# Altium project Bernardo_01.PrjPcb
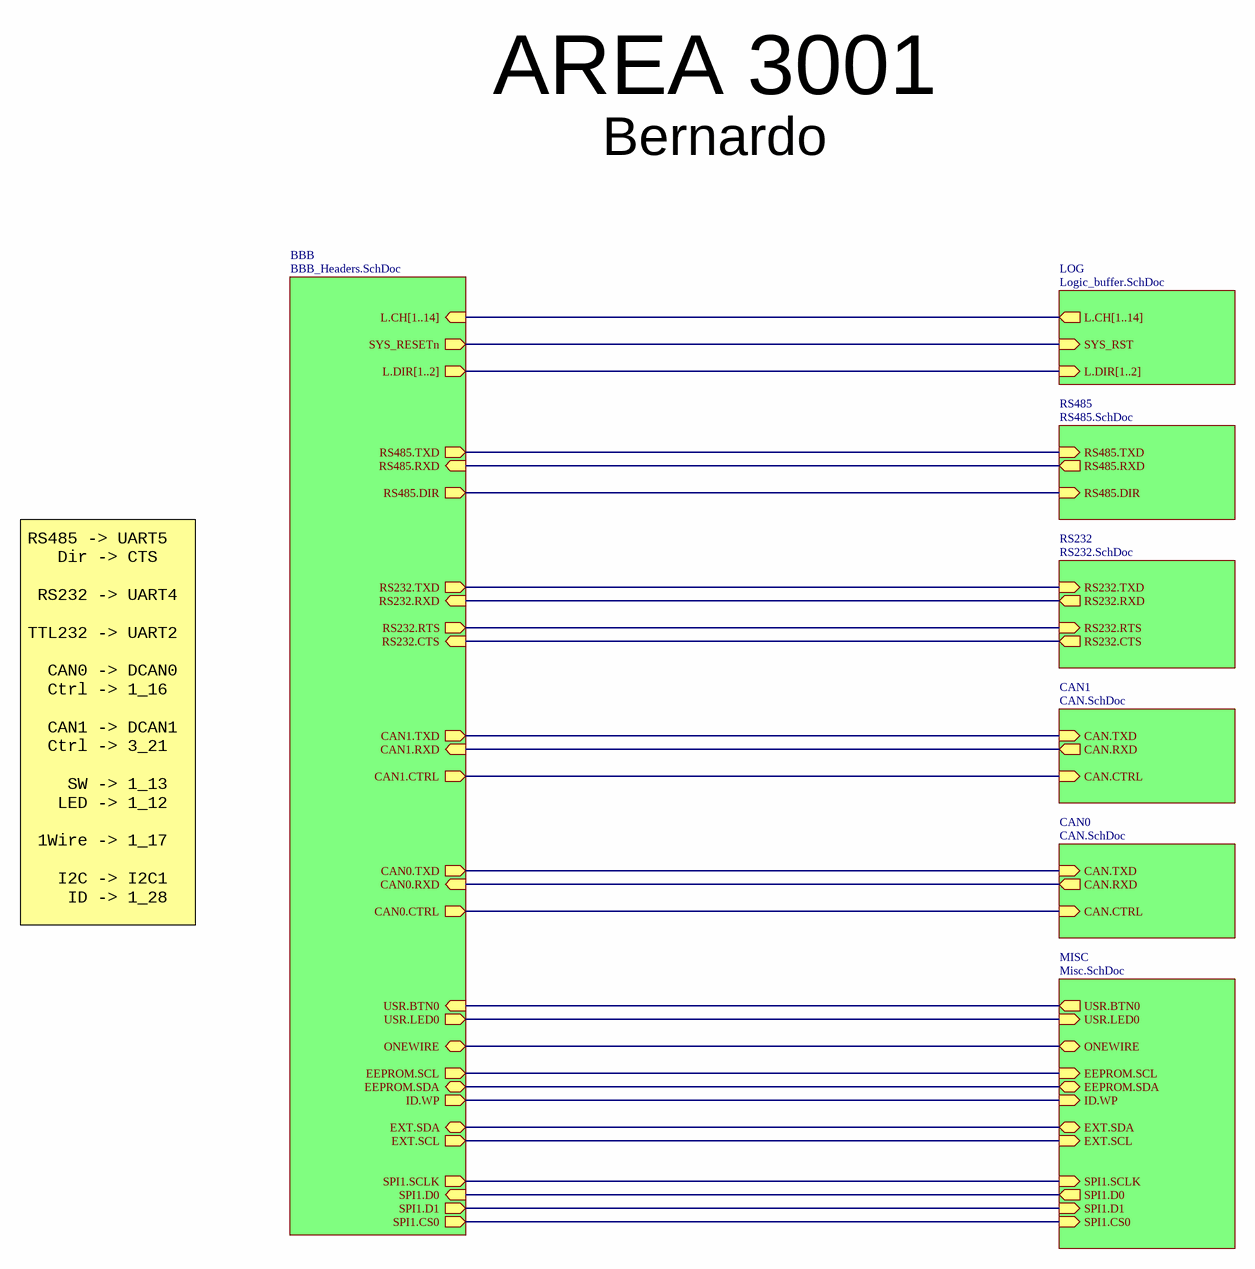
[diagram p0: Bernardo_01.SchDoc]
PCB_ENGINEER: WimVG; PCB_REV: 00; PCB_TITLE: Bernardo
7 sheets, 91 parts. Net scope: hierarchical (ports join the sheet entries above them; power ports are global).
Board file: Bernardo_01.PcbDoc
Sheets:
  Bernardo_01.SchDoc
    MISC = Misc.SchDoc
    RS485 = RS485.SchDoc
    BBB = BBB_Headers.SchDoc
    LOG = Logic_buffer.SchDoc
    RS232 = RS232.SchDoc
    CAN1 = CAN.SchDoc
    CAN0 = CAN.SchDoc

## Sheet Bernardo_01.SchDoc: Bernardo
size A3; Date: 14/11/2018; DrawnBy: Wim Van Gool; Revision: 01; SheetNumber: 1; SheetTotal: 7

### Sub-sheets
BBB = BBB_Headers.SchDoc: RS485.TXD (out), RS485.RXD (in), RS485.DIR (out), USR.BTN0 (in), USR.LED0 (out), EEPROM.SCL (out), EEPROM.SDA (bidir), ID.WP (out), EXT.SDA (bidir), EXT.SCL (out), L.CH[1..14] (in), SYS_RESETn (out), RS232.TXD (out), RS232.RXD (in), RS232.RTS (out), RS232.CTS (in), SPI1.CS0 (out), SPI1.D1 (out), SPI1.SCLK (out), SPI1.D0 (in), L.DIR[1..2] (out), CAN1.RXD (in), CAN1.TXD (out), CAN1.CTRL (out), ONEWIRE (bidir), CAN0.RXD (in), CAN0.TXD (out), CAN0.CTRL (out)
CAN0 = CAN.SchDoc: CAN.CTRL (in), CAN.RXD (out), CAN.TXD (in)
CAN1 = CAN.SchDoc: CAN.CTRL (in), CAN.RXD (out), CAN.TXD (in)
LOG = Logic_buffer.SchDoc: L.CH[1..14] (out), SYS_RST (in), L.DIR[1..2] (in)
MISC = Misc.SchDoc: USR.BTN0 (out), USR.LED0 (in), EEPROM.SDA (bidir), EEPROM.SCL (in), ID.WP (in), EXT.SDA (bidir), EXT.SCL (in), SPI1.SCLK (in), SPI1.D0 (out), SPI1.D1 (in), SPI1.CS0 (in), ONEWIRE (bidir)
RS232 = RS232.SchDoc: RS232.TXD (in), RS232.RXD (out), RS232.RTS (in), RS232.CTS (out)
RS485 = RS485.SchDoc: RS485.TXD (in), RS485.DIR (in), RS485.RXD (out)

### Nets
CAN.CTRL: sheet BBB/CAN0.CTRL, sheet CAN0/CAN.CTRL
CAN.CTRL: sheet BBB/CAN1.CTRL, sheet CAN1/CAN.CTRL  [a separate net that carries the same name]
CAN.RXD: sheet BBB/CAN0.RXD, sheet CAN0/CAN.RXD
CAN.RXD: sheet BBB/CAN1.RXD, sheet CAN1/CAN.RXD  [a separate net that carries the same name]
CAN.TXD: sheet BBB/CAN0.TXD, sheet CAN0/CAN.TXD
CAN.TXD: sheet BBB/CAN1.TXD, sheet CAN1/CAN.TXD  [a separate net that carries the same name]
EEPROM.SCL: sheet MISC/EEPROM.SCL, sheet MISC/EXT.SCL, sheet BBB/EEPROM.SCL, sheet BBB/EXT.SCL
EEPROM.SDA: sheet MISC/EEPROM.SDA, sheet MISC/EXT.SDA, sheet BBB/EEPROM.SDA, sheet BBB/EXT.SDA
GPIO1_12: sheet MISC/USR.LED0, sheet BBB/USR.LED0
GPIO1_13: sheet MISC/USR.BTN0, sheet BBB/USR.BTN0
GPIO1_17: sheet MISC/ONEWIRE, sheet BBB/ONEWIRE
GPIO1_28: sheet MISC/ID.WP, sheet BBB/ID.WP
RS232.CTS: sheet BBB/RS232.CTS, sheet RS232/RS232.CTS
RS232.RTS: sheet BBB/RS232.RTS, sheet RS232/RS232.RTS
RS232.RXD: sheet BBB/RS232.RXD, sheet RS232/RS232.RXD
RS232.TXD: sheet BBB/RS232.TXD, sheet RS232/RS232.TXD
RS485.DIR: sheet RS485/RS485.DIR, sheet BBB/RS485.DIR
RS485.RXD: sheet RS485/RS485.RXD, sheet BBB/RS485.RXD
RS485.TXD: sheet RS485/RS485.TXD, sheet BBB/RS485.TXD
SPI1.CS0: sheet MISC/SPI1.CS0, sheet BBB/SPI1.CS0
SPI1.D0: sheet MISC/SPI1.D0, sheet BBB/SPI1.D0
SPI1.D1: sheet MISC/SPI1.D1, sheet BBB/SPI1.D1
SPI1.SCLK: sheet MISC/SPI1.SCLK, sheet BBB/SPI1.SCLK
SYS_RESETn: sheet BBB/SYS_RESETn, sheet LOG/SYS_RST

### Buses and harness runs
bus sheet BBB/L.CH[1..14] = sheet LOG/L.CH[1..14]
bus sheet BBB/L.DIR[1..2] = sheet LOG/L.DIR[1..2]

### Notes on the sheet
- AREA 3001
- Bernardo
- RS485 -> UART5
  Dir -> CTS
  RS232 -> UART4
  TTL232 -> UART2
  CAN0 -> DCAN0
  Ctrl -> 1_16
  CAN1 -> DCAN1
  Ctrl -> 3_21
  SW -> 1_13
  LED -> 1_12
  1Wire -> 1_17
  I2C -> I2C1
  ID -> 1_28
- Title
- Revision
- Date
- Dranw By
- Size
- A3
- Sheet
- of

## Sheet Misc.SchDoc: Bernardo
size A3; Date: 14/11/2018; DrawnBy: Wim Van Gool; Revision: 01; SheetNumber: 4; SheetTotal: 7
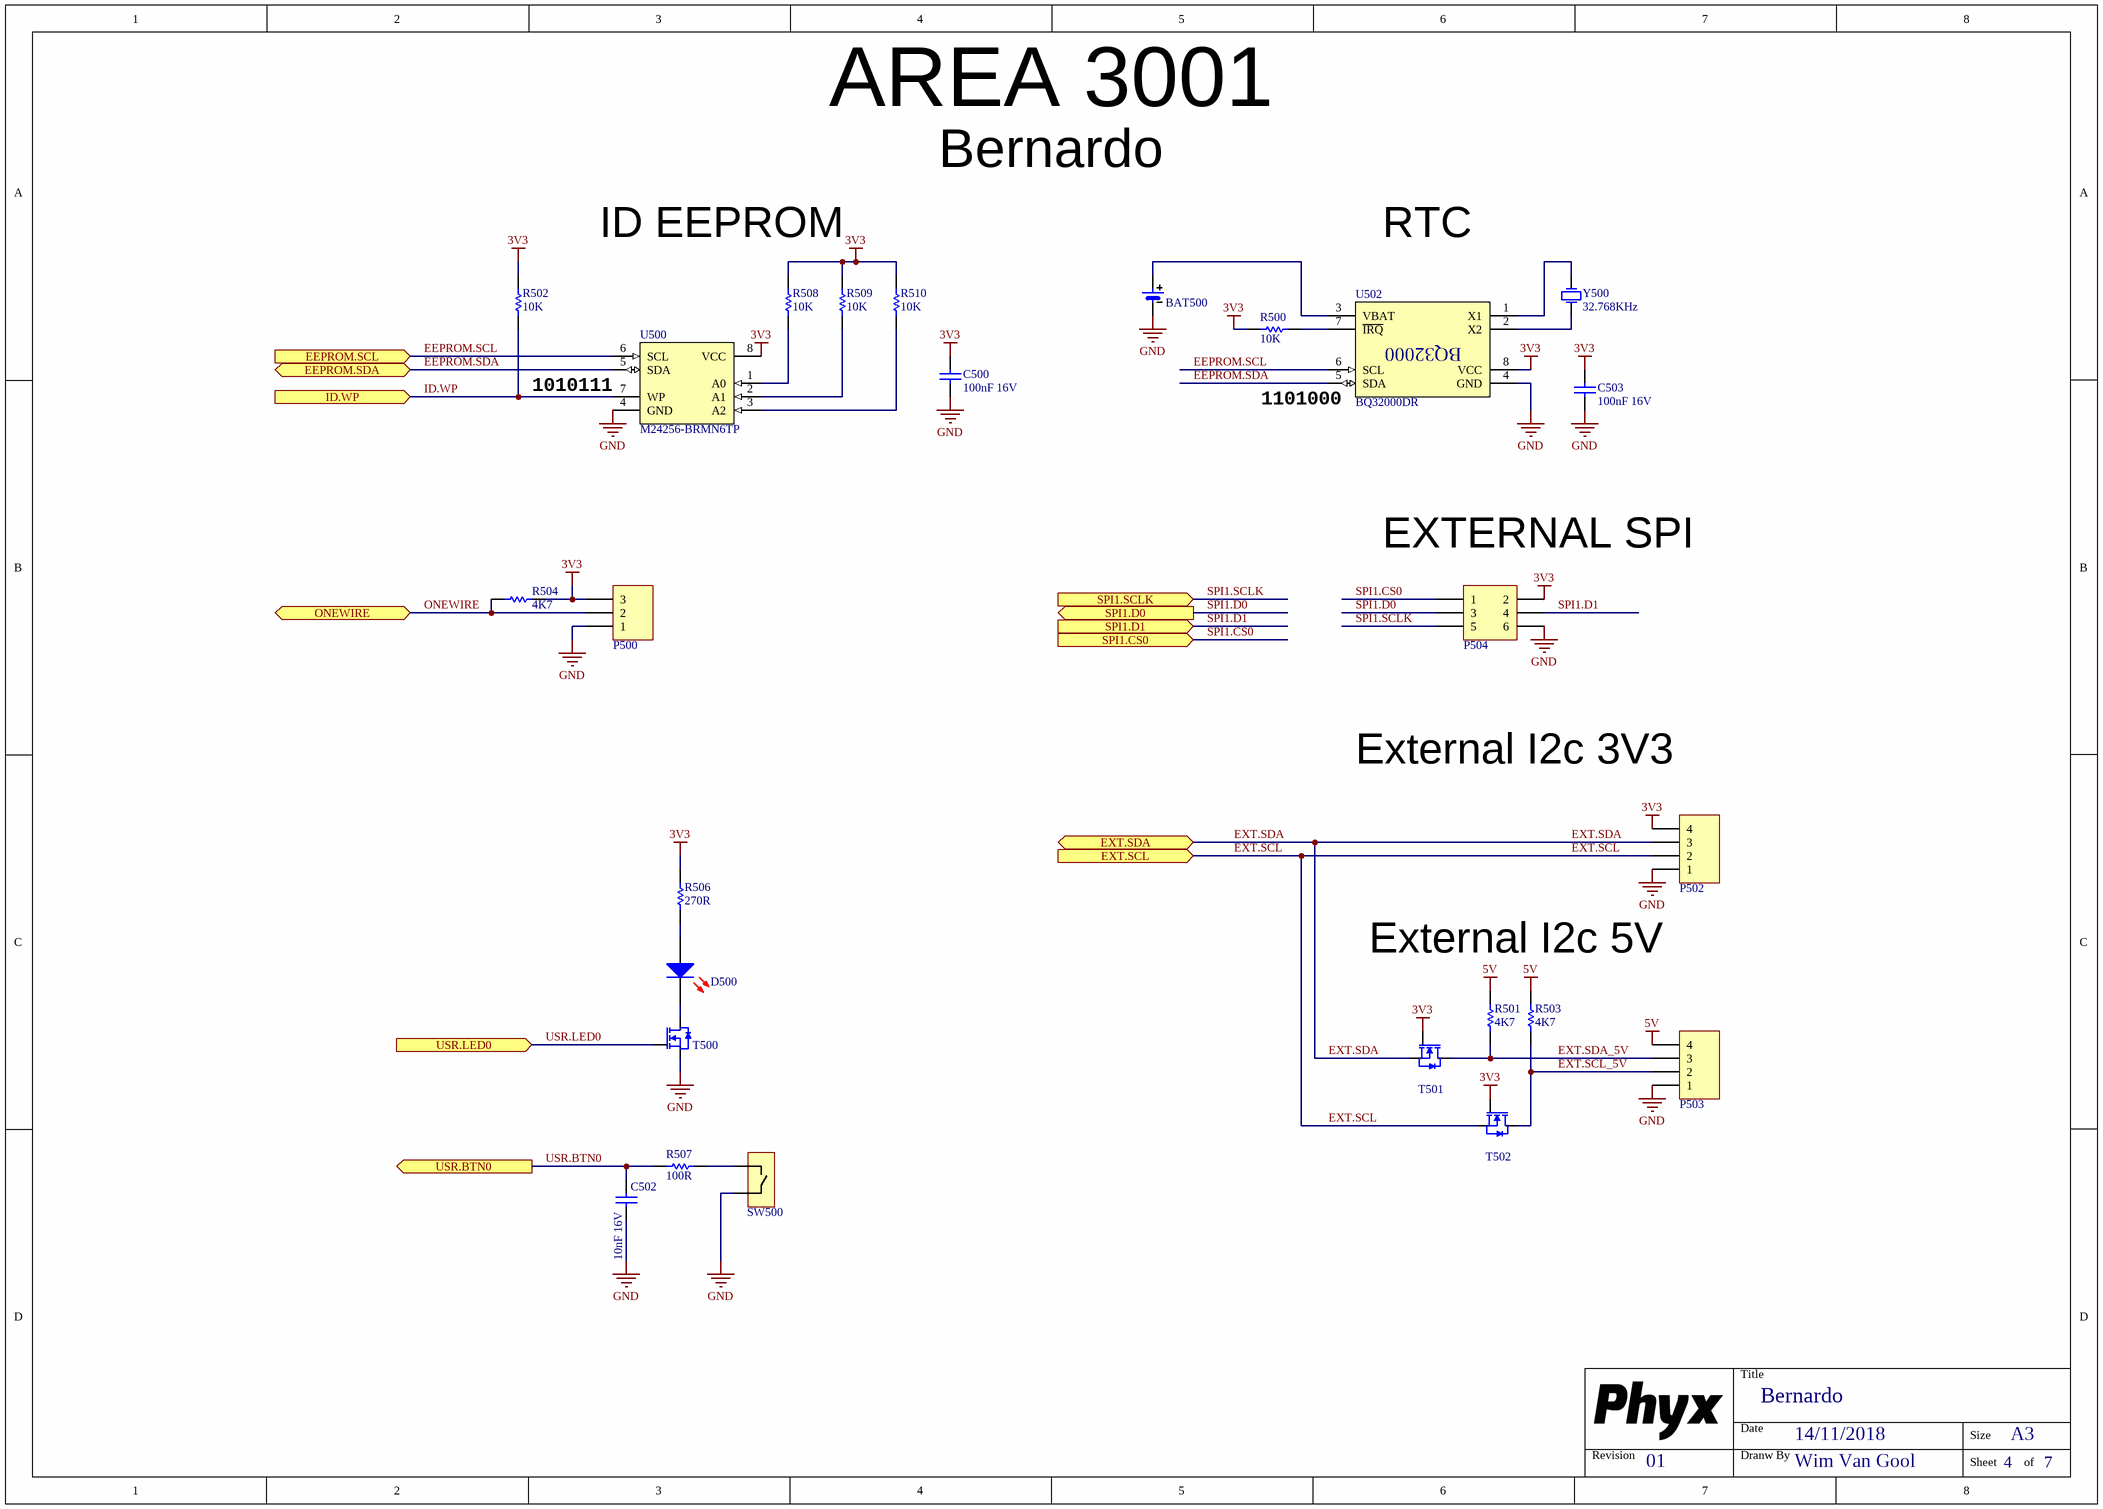
[diagram p1: Misc.SchDoc]

### Parts
BAT500  BR-1220/HFN 35mAh  [BR-1220_HFN]  (value not drawn)
C500  value 100nF 16V  [C0603_N]  (hidden comment: CAP_CERAMIC)
C502  value 10nF 16V  [C0603_N]  (hidden comment: CAP_CERAMIC)
C503  value 100nF 16V  [C0603_N]  (hidden comment: CAP_CERAMIC)
D500  Default 0805 Red LED  [LED_0805_RD]  (value not drawn)
P500  Header 3  [HDR1X3]  (value not drawn)
P502  Header 4  [HDR1X4]  (value not drawn)
P503  Header 4  [HDR1X4]  (value not drawn)
P504  Header 3X2  [HDR2X3]  (value not drawn)
R500  value 10K  [R0603_N]  (hidden comment: RESISTOR)
R501  value 4K7  [R0603_N]  (hidden comment: RESISTOR)
R502  value 10K  [R0603_N]  (hidden comment: RESISTOR)
R503  value 4K7  [R0603_N]  (hidden comment: RESISTOR)
R504  value 4K7  [R0603_N]  (hidden comment: RESISTOR)
R506  value 270R  [R0603_N]  (hidden comment: RESISTOR)
R507  value 100R  [R0603_N]  (hidden comment: RESISTOR)
R508  value 10K  [R0603_N]  (hidden comment: RESISTOR)
R509  value 10K  [R0603_N]  (hidden comment: RESISTOR)
R510  value 10K  [R0603_N]  (hidden comment: RESISTOR)
SW500  Default TH TACT  [TACTSW]  (value not drawn)
T500  0.2A N-Ch MOSFET Vgs 3.2  [SOT23-3]  (value not drawn)
T501  0.2A N-Ch MOSFET Vgs 3.2  [SOT23-3]  (value not drawn)
T502  0.2A N-Ch MOSFET Vgs 3.2  [SOT23-3]  (value not drawn)
U500  value M24256-BRMN6TP  [SOIC_N_8]  (hidden comment: Serial EEPROM 256Kb (8b) I2C)
U502  value BQ32000DR  [SOIC_N_8]  (hidden comment: I2C RTC Ti BQ32000)
Y500  value 32.768KHz  [CMR200T]  (hidden comment: 32.768Khz CMR200 12.5pF)

### Ports
EEPROM.SCL (in), EEPROM.SDA (bidir), EXT.SCL (in), EXT.SDA (bidir), ID.WP (in), ONEWIRE (bidir), SPI1.CS0 (in), SPI1.D0 (out), SPI1.D1 (in), SPI1.SCLK (in), USR.BTN0 (out), USR.LED0 (in)

### Nets
3V3: C500.1 C503.1 P500.3 P502.4 P504.2 R500.1 R502.1 R504.2 R506.1 R508.1 R509.1 R510.1 T501.1(G) T502.1(G) U500.8(VCC) U502.8(VCC)
5V: P503.4 R501.1 R503.1
GND: BAT500.2 C500.2 C502.2 C503.2 P500.1 P502.1 P503.1 P504.6 SW500.2 T500.2(S) U500.4(GND) U502.4(GND)
EEPROM.SCL: P502.2 T502.2(S) U500.6(SCL) U502.6(SCL) ; port EEPROM.SCL, port EXT.SCL  [also labelled EXT.SCL]
EEPROM.SDA: P502.3 T501.2(S) U500.5(SDA) U502.5(SDA) ; port EEPROM.SDA, port EXT.SDA  [also labelled EXT.SDA]
EXT.SCL_5V: P503.2 R503.2 T502.3(D)
EXT.SDA_5V: P503.3 R501.2 T501.3(D)
ID.WP: R502.2 U500.7(WP) ; port ID.WP  [project net GPIO1_28]
ONEWIRE: P500.2 R504.1 ; port ONEWIRE  [project net GPIO1_17]
SPI1.CS0: P504.1 ; port SPI1.CS0
SPI1.D0: P504.3 ; port SPI1.D0
SPI1.D1: P504.4 ; port SPI1.D1
SPI1.SCLK: P504.5 ; port SPI1.SCLK
USR.BTN0: C502.1 R507.2 ; port USR.BTN0  [project net GPIO1_13]
USR.LED0: T500.1(G) ; port USR.LED0  [project net GPIO1_12]
NetBAT500_1: BAT500.1 U502.3(VBAT)
NetD500_1: D500.1(A) R506.2
NetD500_2: D500.2(K) T500.3(D)
NetR500_2: R500.2 U502.7(~{IRQ})
NetR507_1: R507.1 SW500.1
NetR508_2: R508.2 U500.1(A0)
NetR509_2: R509.2 U500.2(A1)
NetR510_2: R510.2 U500.3(A2)
NetU502_1: U502.1(X1) Y500.2(OSC2)
NetU502_2: U502.2(X2) Y500.1(OSC1)

### Notes on the sheet
- AREA 3001
- Bernardo
- ID EEPROM
- RTC
- 1010111
- (near U502) 1101000
- (near P504) EXTERNAL SPI
- External I2c 3V3
- External I2c 5V
- Title
- Revision
- Date
- Dranw By
- Size
- A3
- Sheet
- of

### Library data of the parts
BAT500 = BAT BR-1220/HFN: =Description; Value: 1220; Supplier 1: Farnell; Supplier Part Number 1: 1892653
C500 C503 = CAP # 100nF 16V 0603: Capacitor Ceramic
C502 = CAP # 10nF 16V 0603: Capacitor Ceramic
D500 = LED # Red 0805: =Description; Supplier 1: Farnell; Supplier Part Number 1: 2099236
P500 = Pin Header 2.54mm 3way
P502 P503 = Pin Header 2.54mm 4way
P504 = Pin Header 2.54mm dual row 6way
R500 R502 R508-R510 = RES # 10K 0603: Supplier 1: Farnell; Supplier Part Number 1: 2502397
R501 R503 R504 = RES # 4K7 0603
R506 = RES # 270R 0603: Supplier 1: Farnell; Supplier Part Number 1: 2497841
R507 = RES # 100R 0603
SW500 = SW TACT
T500-T502 = BSS138 N-Ch MOSFET 0.2A 3.2Vgs 60Vds: Value: BSS138; Supplier 1: Farnell; Supplier Part Number 1: 2432717
U500 = EEPROM # I2C 32KKx8b M24256-BRMN6TP: =Description; Supplier 1: Digikey; Supplier Part Number 1: 497-6348-1-ND
U502 = RTC # BQ32000: =Description; Supplier 1: Farnell; Supplier Part Number 1: 1754773
Y500 = XTAL # 32.768Khz 12.5pF CMR200: Crystal Oscillator; Supplier 1: Farnell; Supplier Part Number 1: 2101359

## Sheet RS485.SchDoc: Bernardo
size A3; Date: 14/11/2018; DrawnBy: Wim Van Gool; Revision: 01; SheetNumber: 5; SheetTotal: 7
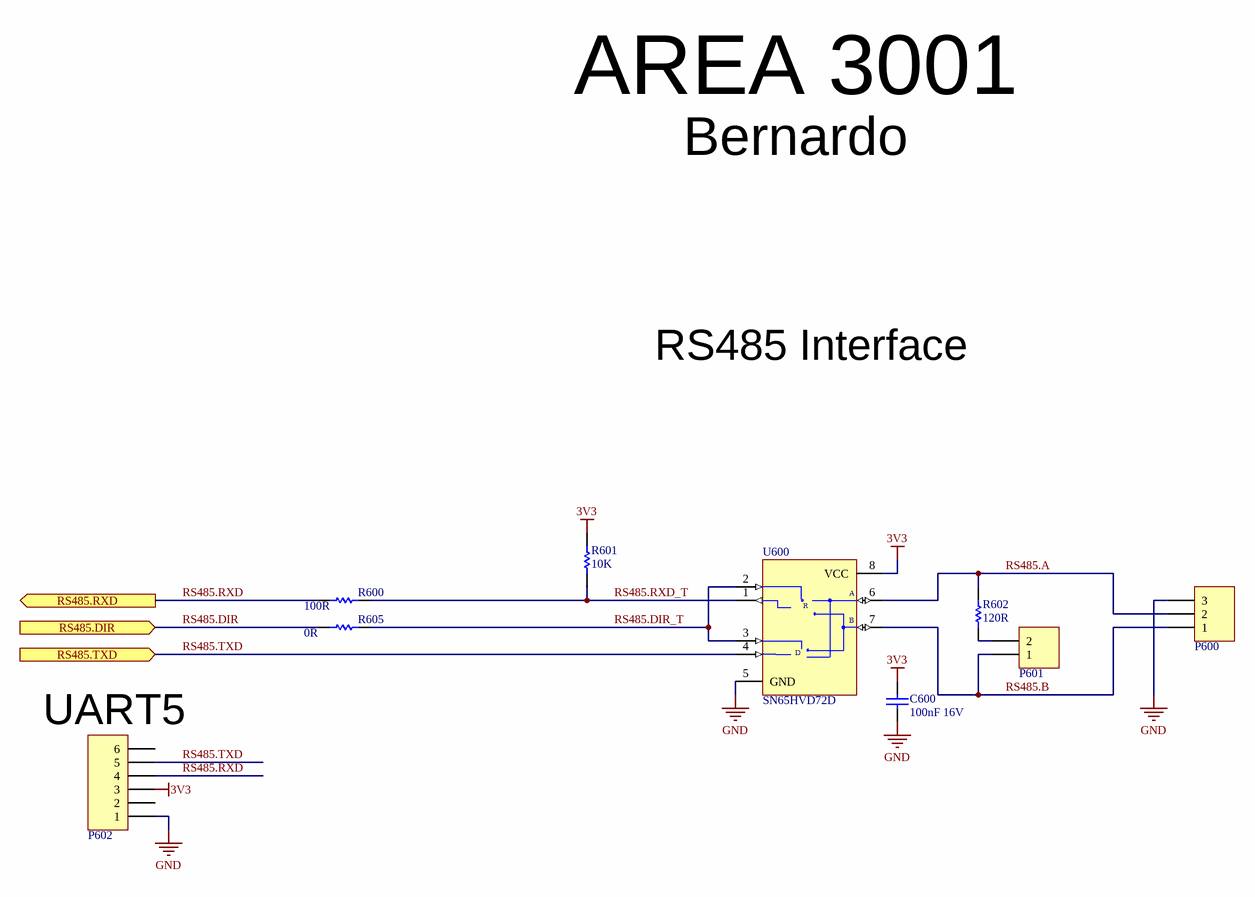
[diagram p2: RS485.SchDoc]

### Parts
C600  value 100nF 16V  [C0603_N]  (hidden comment: CAP_CERAMIC)
P600  3 Terminal Socket 2,5mm  [WE_691382000003]  (value not drawn)
P601  Header 2  [HDR1X2]  (value not drawn)
P602  Header 6  [HDR1X6]  (value not drawn)
R600  value 100R  [R0603_N]  (hidden comment: RESISTOR)
R601  value 10K  [R0603_N]  (hidden comment: RESISTOR)
R602  value 120R  [R1206]  (hidden comment: RESISTOR)
R605  value 0R  [R0603_N]  (hidden comment: RESISTOR)
U600  value SN65HVD72D  [SOIC_N_8]  (hidden comment: RS-485 3V3 Transceiver 250kbps)

### Ports
RS485.DIR (in), RS485.RXD (out), RS485.TXD (in)

### Nets
3V3: C600.1 P602.3 R601.1 U600.8(VCC)
GND: C600.2 P600.3 P602.1 U600.5(GND)
RS485.A: P600.2 R602.1 U600.6(A)
RS485.B: P600.1 P601.1 U600.7(B)
RS485.DIR: R605.2 ; port RS485.DIR
RS485.DIR_T: R605.1 U600.2(~{RE}) U600.3(DE)
RS485.RXD: P602.4 R600.2 ; port RS485.RXD
RS485.RXD_T: R600.1 R601.2 U600.1(RO)
RS485.TXD: P602.5 U600.4(DI) ; port RS485.TXD
NetP601_2: P601.2 R602.2

Not connected (* = marked no-connect by the designer): P602 2 6

### Notes on the sheet
- AREA 3001
- Bernardo
- RS485 Interface
- (near P602) UART5
- Title
- Revision
- Date
- Dranw By
- Size
- A3
- Sheet
- of
- (in symbol SN65HVD72D # RS-485 transceiver) R; D

### Library data of the parts
C600 = CAP # 100nF 16V 0603: Capacitor Ceramic
P600 = Terminal Block Socket 2,5mm 3way - 691382000003: Value: 691382000003; Supplier 1: Wurth; Supplier Part Number 1: 691382000003
P601 = Pin Header 2.54mm 2way
P602 = Pin Header 2.54mm 6way
R600 = RES # 100R 0603
R601 = RES # 10K 0603: Supplier 1: Farnell; Supplier Part Number 1: 2502397
R602 = RES # 120R 1206
R605 = RES # 0R 0603: Supplier 1: Farnell; Supplier Part Number 1: 2447743
U600 = SN65HVD72D # RS-485 transceiver: Supplier 1: Farnell; Supplier Part Number 1: 2335547

## Sheet BBB_Headers.SchDoc: Bernardo
size A3; Date: 14/11/2018; DrawnBy: Wim Van Gool; Revision: 01; SheetNumber: 2; SheetTotal: 7
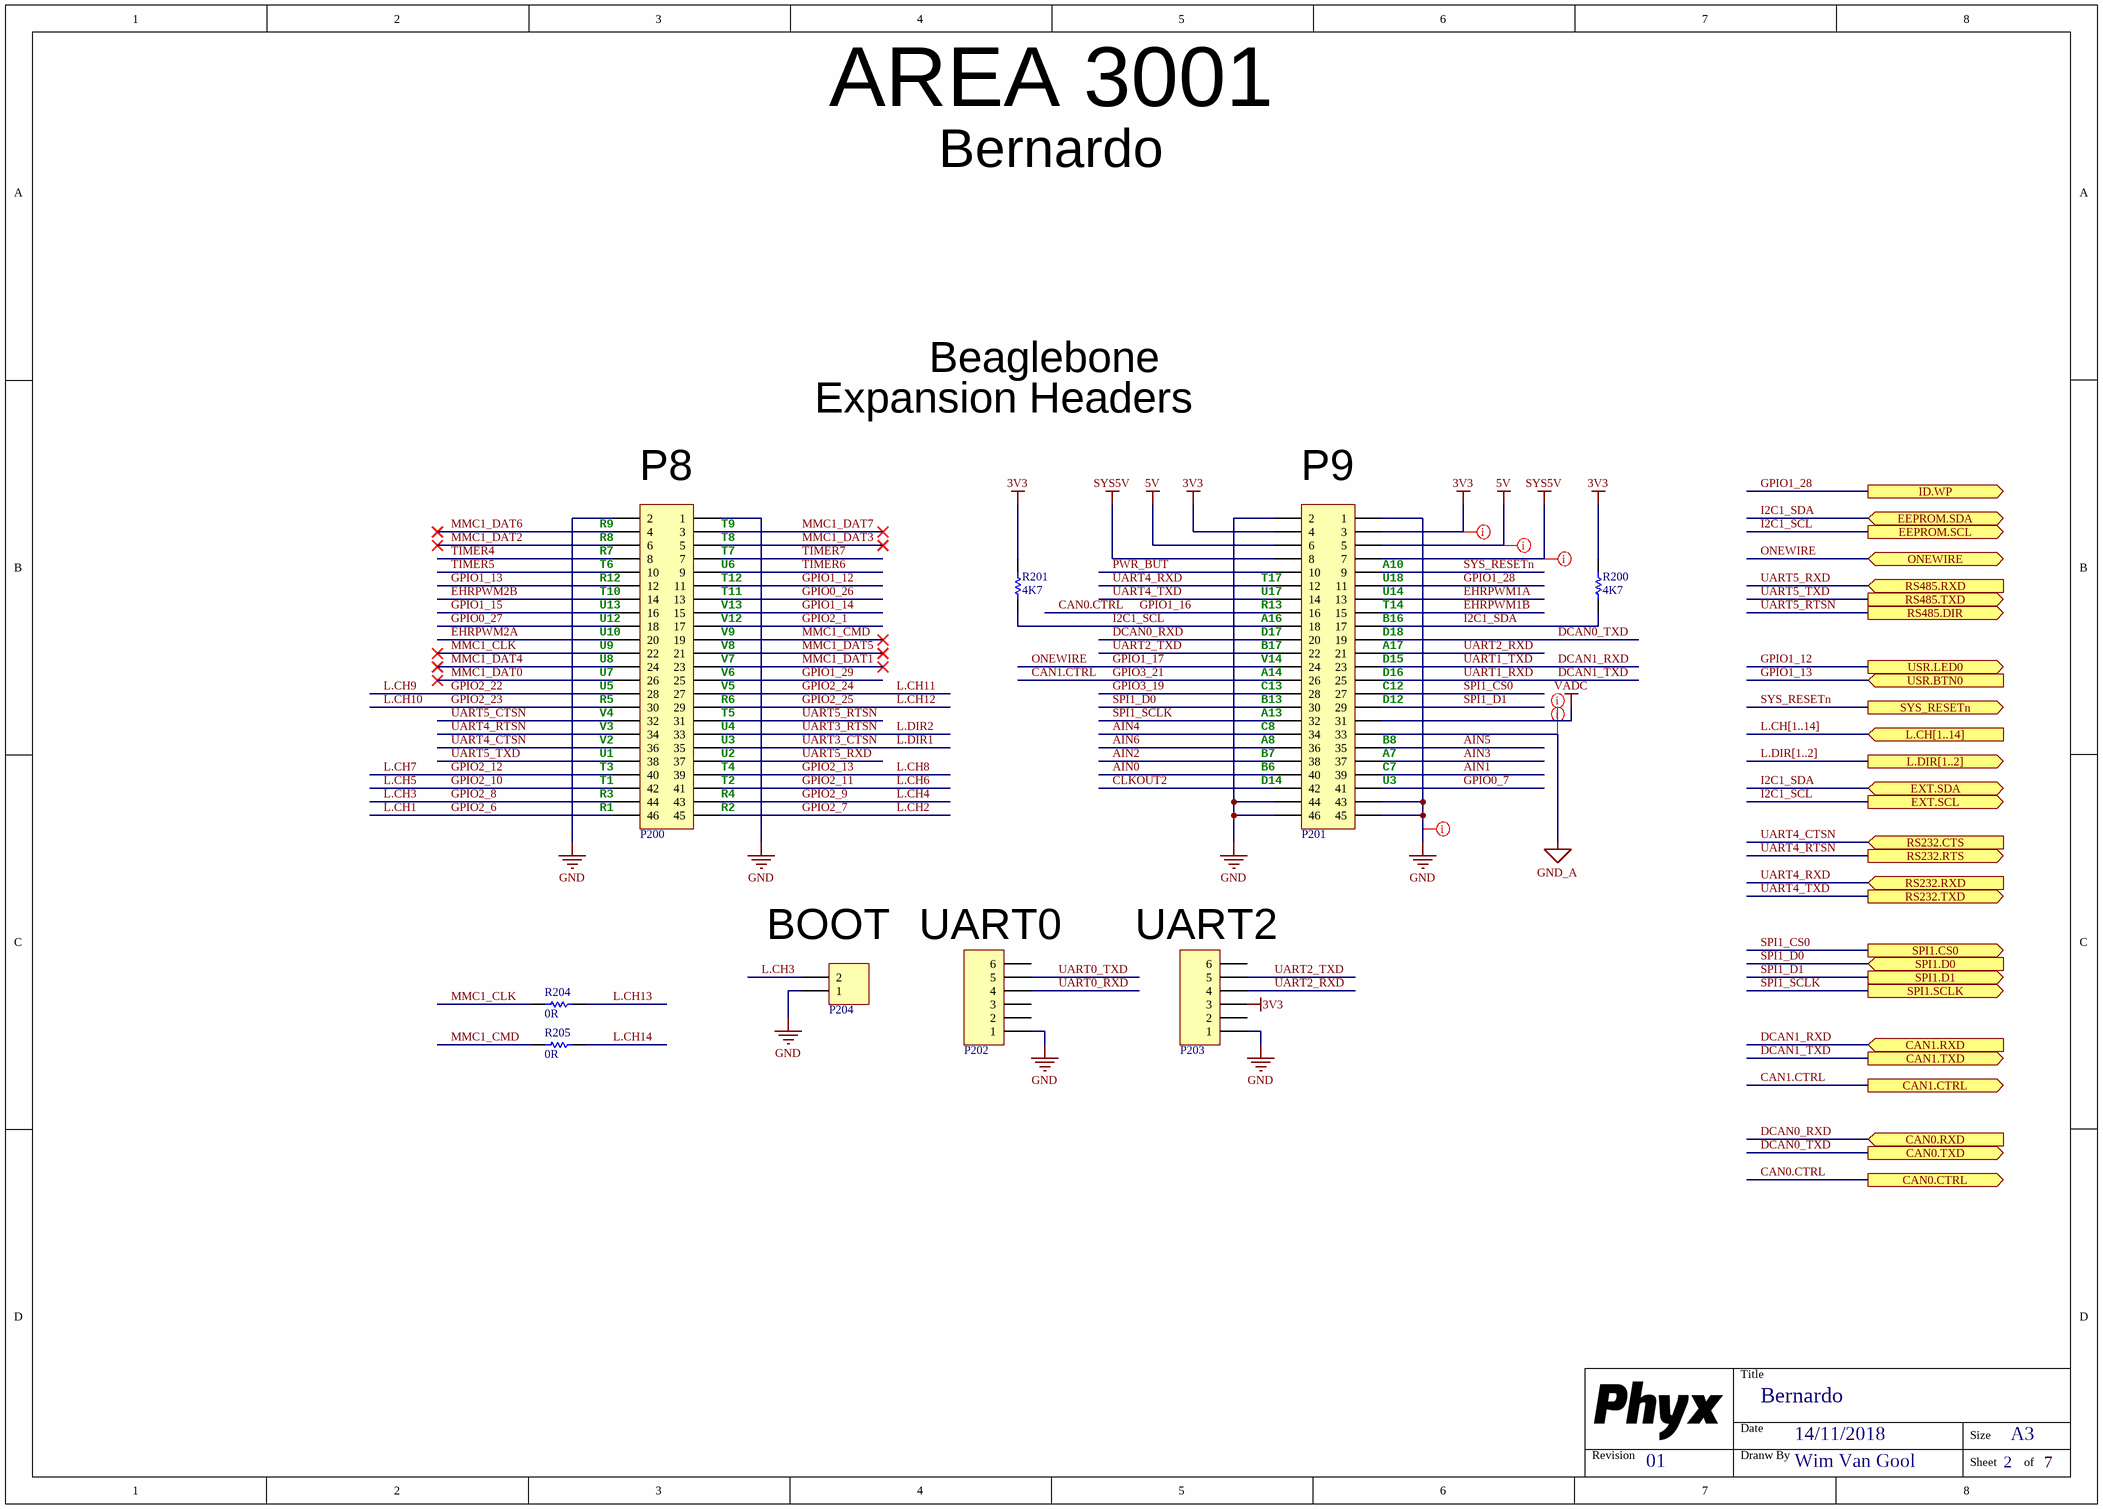
[diagram p3: BBB_Headers.SchDoc]

### Parts
P200  Receptacle 23X2  [HDR2X23]  (value not drawn)
P201  Receptacle 23X2  [HDR2X23]  (value not drawn)
P202  Receptacle 6  [RCPT1X6]  (value not drawn)
P203  Header 6  [HDR1X6]  (value not drawn)
P204  Header 2  [HDR1X2]  (value not drawn)
R200  value 4K7  [R0603_N]  (hidden comment: RESISTOR)
R201  value 4K7  [R0603_N]  (hidden comment: RESISTOR)
R204  value 0R  [R0603_N]  (hidden comment: RESISTOR)
R205  value 0R  [R0603_N]  (hidden comment: RESISTOR)

### Ports
CAN0.CTRL (out), CAN0.RXD (in), CAN0.TXD (out), CAN1.CTRL (out), CAN1.RXD (in), CAN1.TXD (out), EEPROM.SCL (out), EEPROM.SDA (bidir), EXT.SCL (out), EXT.SDA (bidir), ID.WP (out), L.CH[1..14] (in), L.DIR[1..2] (out), ONEWIRE (bidir), RS232.CTS (in), RS232.RTS (out), RS232.RXD (in), RS232.TXD (out), RS485.DIR (out), RS485.RXD (in), RS485.TXD (out), SPI1.CS0 (out), SPI1.D0 (in), SPI1.D1 (out), SPI1.SCLK (out), SYS_RESETn (out), USR.BTN0 (in), USR.LED0 (out)

### Nets
3V3: P201.3 P201.4 P203.3 R200.1 R201.2
5V: P201.5 P201.6
GND: P200.1 P200.2 P201.1 P201.2 P201.43 P201.44 P201.45 P201.46 P202.1 P203.1 P204.1
GND_A: P201.33
SYS5V: P201.7 P201.8
VADC: P201.31
AIN0: P201.40
AIN1: P201.39
AIN2: P201.38
AIN3: P201.37
AIN4: P201.34
AIN5: P201.35
AIN6: P201.36
CAN0.CTRL: P201.16 ; port CAN0.CTRL  [also labelled GPIO1_16]  [project net CAN.CTRL]
CAN1.CTRL: P201.26 ; port CAN1.CTRL  [also labelled GPIO3_21]  [project net CAN.CTRL]
CLKOUT2: P201.42
DCAN0_RXD: P201.20 ; port CAN0.RXD  [project net CAN.RXD]
DCAN0_TXD: P201.19 ; port CAN0.TXD  [project net CAN.TXD]
DCAN1_RXD: P201.23 ; port CAN1.RXD  [also labelled UART1_TXD]  [project net CAN.RXD]
DCAN1_TXD: P201.25 ; port CAN1.TXD  [also labelled UART1_RXD]  [project net CAN.TXD]
EHRPWM1A: P201.13
EHRPWM1B: P201.15
EHRPWM2A: P200.20
EHRPWM2B: P200.14
GPIO0_7: P201.41
GPIO0_26: P200.13
GPIO0_27: P200.18
GPIO1_12: P200.11 ; port USR.LED0
GPIO1_13: P200.12 ; port USR.BTN0
GPIO1_14: P200.15
GPIO1_15: P200.16
GPIO1_17: P201.24 ; port ONEWIRE  [also labelled ONEWIRE]
GPIO1_28: P201.11 ; port ID.WP
GPIO1_29: P200.25
GPIO2_1: P200.17
GPIO2_6: P200.46  [also labelled L.CH1]
GPIO2_7: P200.45  [also labelled L.CH2]
GPIO2_8: P200.44 P204.2  [also labelled L.CH3]
GPIO2_9: P200.43  [also labelled L.CH4]
GPIO2_10: P200.42  [also labelled L.CH5]
GPIO2_11: P200.41  [also labelled L.CH6]
GPIO2_12: P200.40  [also labelled L.CH7]
GPIO2_13: P200.39  [also labelled L.CH8]
GPIO2_22: P200.28  [also labelled L.CH9]
GPIO2_23: P200.30  [also labelled L.CH10]
GPIO2_24: P200.27  [also labelled L.CH11]
GPIO2_25: P200.29  [also labelled L.CH12]
GPIO3_19: P201.28
I2C1_SCL: P201.18 R201.1 ; port EEPROM.SCL, port EXT.SCL  [project net EEPROM.SCL]
I2C1_SDA: P201.17 R200.2 ; port EEPROM.SDA, port EXT.SDA  [project net EEPROM.SDA]
L.CH13: R204.1
L.CH14: R205.1
L.DIR1: P200.35  [also labelled UART3_CTSN]
L.DIR2: P200.33  [also labelled UART3_RTSN]
MMC1_CLK: P200.22 R204.2
MMC1_CMD: P200.19 R205.2
MMC1_DAT0: P200.26
MMC1_DAT1: P200.23
MMC1_DAT2: P200.6
MMC1_DAT3: P200.5
MMC1_DAT4: P200.24
MMC1_DAT5: P200.21
MMC1_DAT6: P200.4
MMC1_DAT7: P200.3
PWR_BUT: P201.10
SPI1_CS0: P201.27 ; port SPI1.CS0  [project net SPI1.CS0]
SPI1_D0: P201.30 ; port SPI1.D0  [project net SPI1.D0]
SPI1_D1: P201.29 ; port SPI1.D1  [project net SPI1.D1]
SPI1_SCLK: P201.32 ; port SPI1.SCLK  [project net SPI1.SCLK]
SYS_RESETn: P201.9 ; port SYS_RESETn
TIMER4: P200.8
TIMER5: P200.10
TIMER6: P200.9
TIMER7: P200.7
UART0_RXD: P202.4
UART0_TXD: P202.5
UART2_RXD: P201.21 P203.4
UART2_TXD: P201.22 P203.5
UART4_CTSN: P200.36 ; port RS232.CTS  [project net RS232.CTS]
UART4_RTSN: P200.34 ; port RS232.RTS  [project net RS232.RTS]
UART4_RXD: P201.12 ; port RS232.RXD  [project net RS232.RXD]
UART4_TXD: P201.14 ; port RS232.TXD  [project net RS232.TXD]
UART5_CTSN: P200.32
UART5_RTSN: P200.31 ; port RS485.DIR  [project net RS485.DIR]
UART5_RXD: P200.37 ; port RS485.RXD  [project net RS485.RXD]
UART5_TXD: P200.38 ; port RS485.TXD  [project net RS485.TXD]

Not connected (* = marked no-connect by the designer): P202 2 3 6; P203 2 6

### Buses and harness runs
bus L.CH[1..14] = port L.CH[1..14]
bus L.DIR[1..2] = port L.DIR[1..2]

### Layout directives
net class POWER: 3V3, 5V, GND, GND_A, SYS5V, VADC

### Notes on the sheet
- AREA 3001
- Bernardo
- Beaglebone
- Expansion Headers
- (near P200) P8
- (near P201) P9
- (near P200) R9
- (near P200) R8
- (near P200) R7
- (near P200) T6
- (near P200) R12
- (near P200) T9
- (near P200) T8
- (near P200) T7
- (near P200) U6
- (near P200) T12
- (near P201) T17
- (near P201) A10
- (near P201) U18
- (near P200) T10
- (near P200) U13
- (near P200) U12
- (near P200) U10
- (near P200) U9
- (near P200) T11
- (near P200) V13
- (near P200) V12
- (near P200) V9
- (near P200) V8
- (near P201) U17
- (near P201) R13
- (near P201) A16
- (near P201) D17
- (near P201) B17
- (near P201) U14
- (near P201) T14
- (near P201) B16
- (near P201) D18
- (near P201) A17
- (near P200) U8
- (near P200) U7
- (near P200) U5
- (near P200) R5
- (near P200) V4
- (near P200) V7
- (near P200) V6
- (near P200) V5
- (near P200) R6
- (near P200) T5
- (near P201) V14
- (near P201) A14
- (near P201) C13
- (near P201) B13
- (near P201) A13
- (near P201) D15
- (near P201) D16
- (near P201) C12
- (near P201) D12
- (near P200) V3
- (near P200) V2
- (near P200) U1
- (near P200) T3
- (near P200) T1
- (near P200) U4
- (near P200) U3
- (near P200) U2
- (near P200) T4
- (near P200) T2
- (near P201) C8
- (near P201) A8
- (near P201) B7
- (near P201) B6
- (near P201) D14
- (near P201) B8
- (near P201) A7
- (near P201) C7
- (near P201) U3
- (near P200) R3
- (near P200) R1
- (near P200) R4
- (near P200) R2
- (near P204) BOOT
- (near P202) UART0
- (near P203) UART2
- Title
- Revision
- Date
- Dranw By
- Size
- A3
- Sheet
- of

### Library data of the parts
P200 P201 = Pin Header 2.54mm dual row 46way: =Description
P202 = Receptacle 2.54mm 6way
P203 = Pin Header 2.54mm 6way
P204 = Pin Header 2.54mm 2way
R200 R201 = RES # 4K7 0603
R204 R205 = RES # 0R 0603: Supplier 1: Farnell; Supplier Part Number 1: 2447743

## Sheet Logic_buffer.SchDoc: Bernardo
size A3; Date: 14/11/2018; DrawnBy: Wim Van Gool; Revision: 01; SheetNumber: 3; SheetTotal: 7
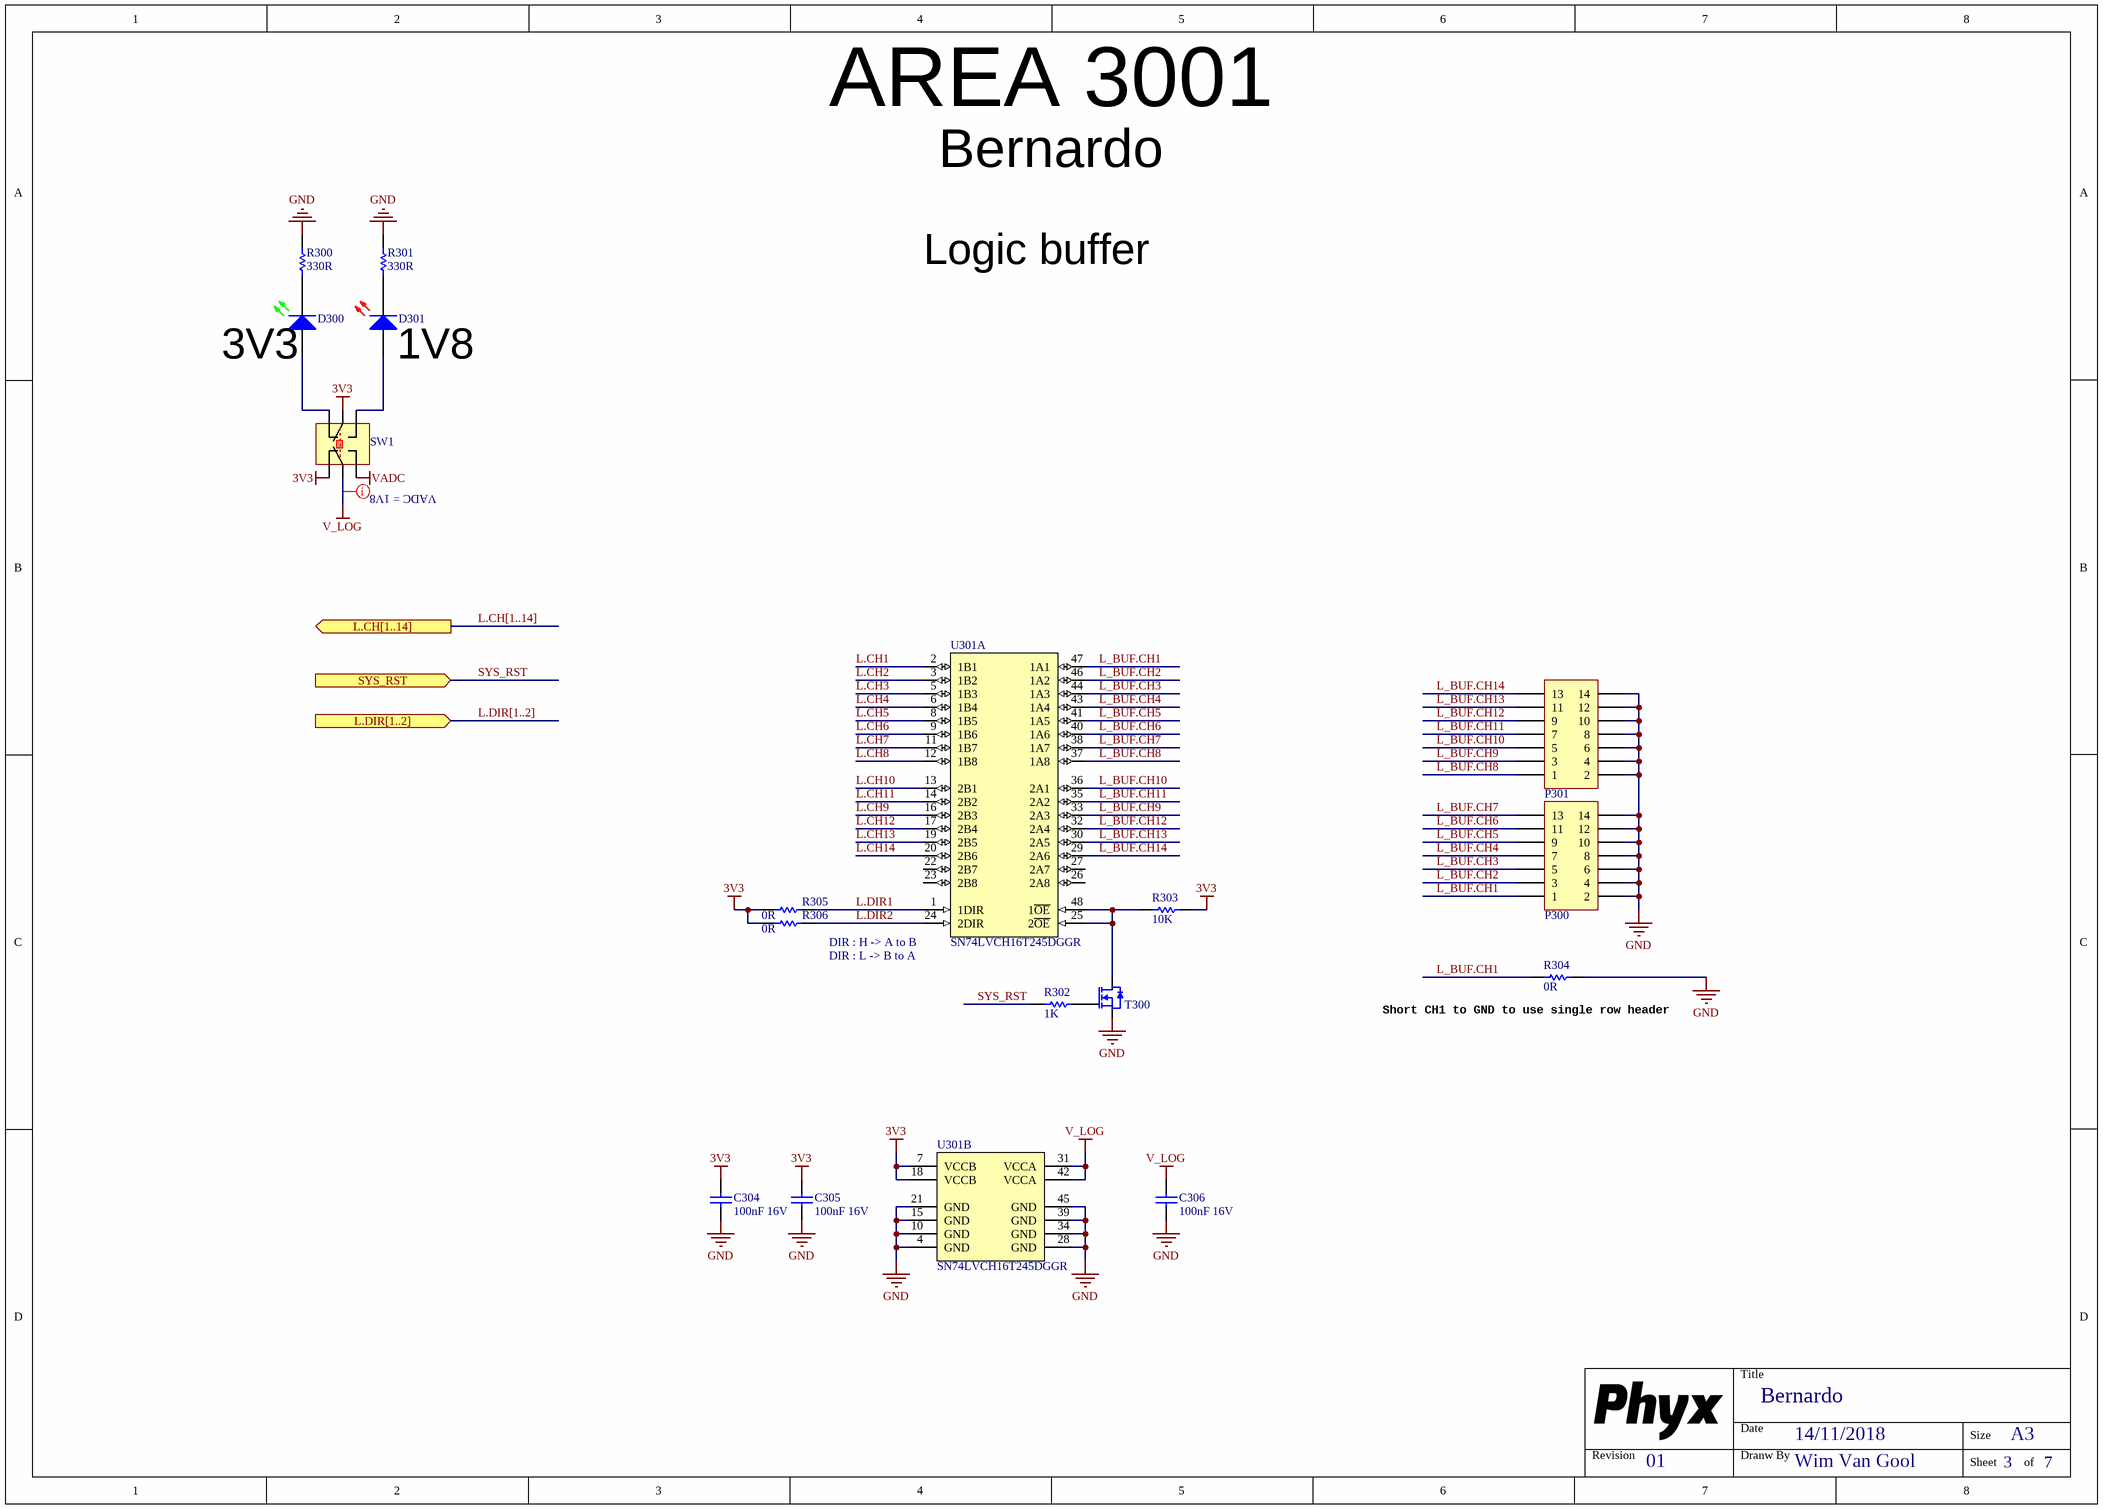
[diagram p4: Logic_buffer.SchDoc]

### Parts
C304  value 100nF 16V  [C0603_N]  (hidden comment: CAP_CERAMIC)
C305  value 100nF 16V  [C0603_N]  (hidden comment: CAP_CERAMIC)
C306  value 100nF 16V  [C0603_N]  (hidden comment: CAP_CERAMIC)
D300  Default 0805 Green LED  [LED_0805_GR]  (value not drawn)
D301  Default 0805 Red LED  [LED_0805_RD]  (value not drawn)
P300  Header 7X2  [HDR2X7]  (value not drawn)
P301  Header 7X2  [HDR2X7]  (value not drawn)
R300  value 330R  [R0603_N]  (hidden comment: RESISTOR)
R301  value 330R  [R0603_N]  (hidden comment: RESISTOR)
R302  value 1K  [R0603_N]  (hidden comment: RESISTOR)
R303  value 10K  [R0603_N]  (hidden comment: RESISTOR)
R304  value 0R  [R0603_N]  (hidden comment: RESISTOR)
R305  value 0R  [R0603_N]  (hidden comment: RESISTOR)
R306  value 0R  [R0603_N]  (hidden comment: RESISTOR)
SW1  mini Switch 2 pole double throw straight 50V 0.3A  [SS22D07]  (value not drawn)
T300  0.2A N-Ch MOSFET Vgs 3.2  [SOT23-3]  (value not drawn)
U301  value SN74LVCH16T245DGGR  [TI_DGG_R-PDSO-G48]  (hidden comment: SN74LVCH16T245DGGR  Bus Transceiver LVC 16Ch 32 mA 6 ns 1V65 to 5V5 TSSOP48)  (parts A,B of 2)

### Ports
L.CH[1..14] (out), L.DIR[1..2] (in), SYS_RST (in)

### Nets
3V3: C304.1 C305.1 R303.1 R305.2 R306.2 SW1.2 SW1.3 U301.7(VCCB) U301.18(VCCB)
GND: C304.2 C305.2 C306.2 P300.2 P300.4 P300.6 P300.8 P300.10 P300.12 P300.14 P301.2 P301.4 P301.6 P301.8 P301.10 P301.12 P301.14 R300.1 R301.1 R304.1 T300.2(S) U301.4(GND) U301.10(GND) U301.15(GND) U301.21(GND) U301.28(GND) U301.34(GND) U301.39(GND) U301.45(GND)
V_LOG: C306.1 SW1.4 U301.31(VCCA) U301.42(VCCA)
VADC: SW1.6
L.CH1: U301.2(1B1)  [project net GPIO2_6]
L.CH2: U301.3(1B2)  [project net GPIO2_7]
L.CH3: U301.5(1B3)  [project net GPIO2_8]
L.CH4: U301.6(1B4)  [project net GPIO2_9]
L.CH5: U301.8(1B5)  [project net GPIO2_10]
L.CH6: U301.9(1B6)  [project net GPIO2_11]
L.CH7: U301.11(1B7)  [project net GPIO2_12]
L.CH8: U301.12(1B8)  [project net GPIO2_13]
L.CH9: U301.16(2B3)  [project net GPIO2_22]
L.CH10: U301.13(2B1)  [project net GPIO2_23]
L.CH11: U301.14(2B2)  [project net GPIO2_24]
L.CH12: U301.17(2B4)  [project net GPIO2_25]
L.CH13: U301.19(2B5)
L.CH14: U301.20(2B6)
L.DIR1: R305.1 U301.1(1DIR)
L.DIR2: R306.1 U301.24(2DIR)
L_BUF.CH1: P300.1 R304.2 U301.47(1A1)
L_BUF.CH2: P300.3 U301.46(1A2)
L_BUF.CH3: P300.5 U301.44(1A3)
L_BUF.CH4: P300.7 U301.43(1A4)
L_BUF.CH5: P300.9 U301.41(1A5)
L_BUF.CH6: P300.11 U301.40(1A6)
L_BUF.CH7: P300.13 U301.38(1A7)
L_BUF.CH8: P301.1 U301.37(1A8)
L_BUF.CH9: P301.3 U301.33(2A3)
L_BUF.CH10: P301.5 U301.36(2A1)
L_BUF.CH11: P301.7 U301.35(2A2)
L_BUF.CH12: P301.9 U301.32(2A4)
L_BUF.CH13: P301.11 U301.30(2A5)
L_BUF.CH14: P301.13 U301.29(2A6)
SYS_RST: R302.2 ; port SYS_RST  [project net SYS_RESETn]
NetD300_1: D300.1(A) SW1.1
NetD300_2: D300.2(K) R300.2
NetD301_1: D301.1(A) SW1.5
NetD301_2: D301.2(K) R301.2
NetR302_1: R302.1 T300.1(G)
NetR303_2: R303.2 T300.3(D) U301.25(2~{OE}) U301.48(1~{OE})

Not connected (* = marked no-connect by the designer): U301 22(2B7) 23(2B8) 26(2A8) 27(2A7)

### Buses and harness runs
bus L.CH[1..14] = port L.CH[1..14]
bus L.DIR[1..2] = port L.DIR[1..2]

### Layout directives
net class POWER: V_LOG

### Notes on the sheet
- AREA 3001
- Bernardo
- Logic buffer
- (near D300) 3V3
- (near D301) 1V8
- (near SW1) VADC = 1V8
- DIR : H -> A to B
- DIR : L -> B to A
- (near R304) Short CH1 to GND to use single row header
- Title
- Revision
- Date
- Dranw By
- Size
- A3
- Sheet
- of

### Library data of the parts
C304-C306 = CAP # 100nF 16V 0603: Capacitor Ceramic
D300 = LED # Green 0805: =Description; Supplier 1: Farnell; Supplier Part Number 1: 2099239
D301 = LED # Red 0805: =Description; Supplier 1: Farnell; Supplier Part Number 1: 2099236
P300 P301 = Pin Header 2.54mm dual row 14way
R300 R301 = RES # 330R 0603: Supplier 1: Farnell; Supplier Part Number 1: 2446656
R302 = RES # 1K 0603
R303 = RES # 10K 0603: Supplier 1: Farnell; Supplier Part Number 1: 2502397
R304-R306 = RES # 0R 0603: Supplier 1: Farnell; Supplier Part Number 1: 2447743
SW1 = SW 2P2T micro straight SS22D07: Value: SS22D07; Supplier 1: AliExpress
T300 = BSS138 N-Ch MOSFET 0.2A 3.2Vgs 60Vds: Value: BSS138; Supplier 1: Farnell; Supplier Part Number 1: 2432717
U301 = LVL # 16Ch SN74LVCH16T245DGGR: =Description; Supplier 1: Farnell; Supplier Part Number 1: 2308692

## Sheet RS232.SchDoc: Bernardo
size A3; Date: 14/11/2018; DrawnBy: Wim Van Gool; Revision: 01; SheetNumber: 6; SheetTotal: 7
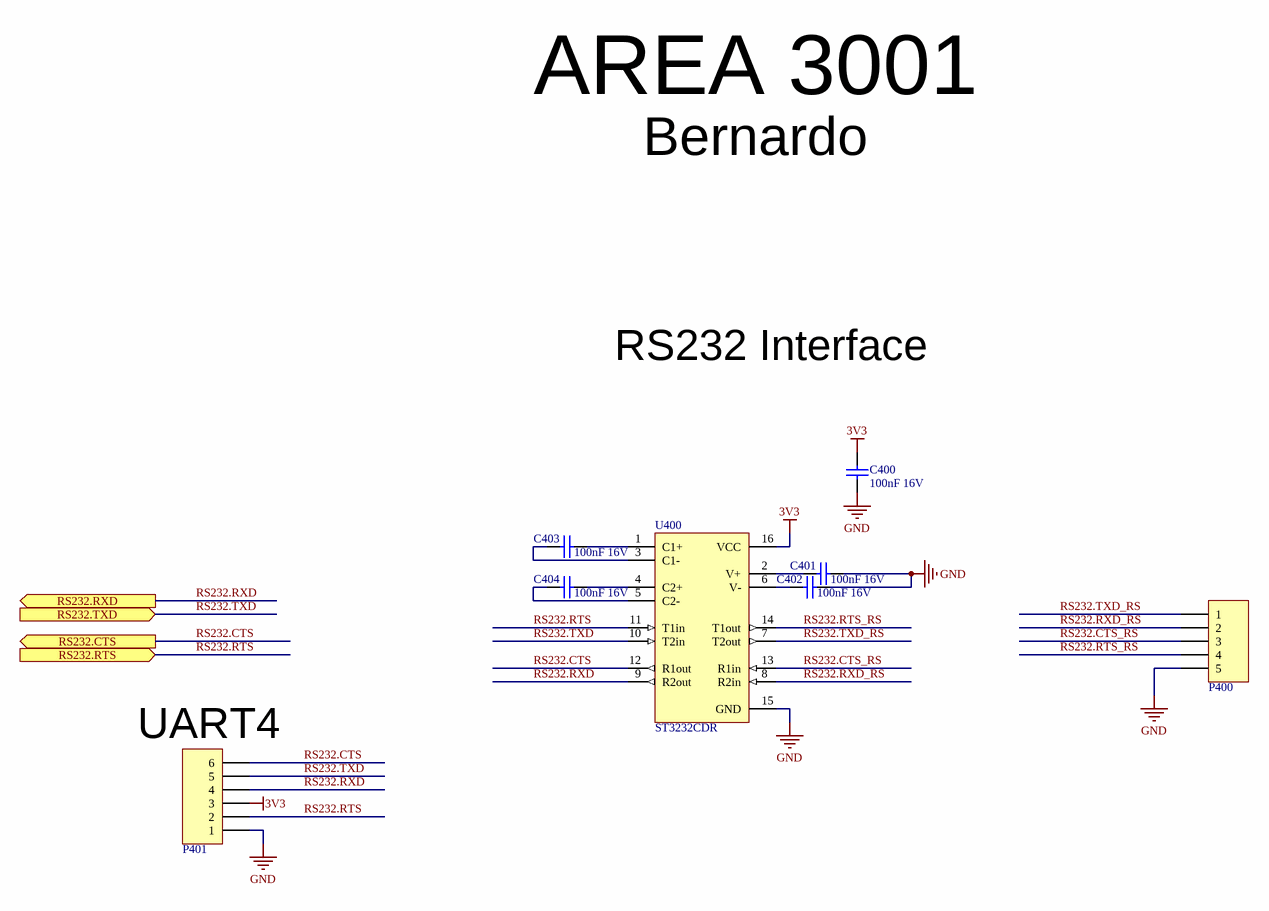
[diagram p5: RS232.SchDoc]

### Parts
C400  value 100nF 16V  [C0603_N]  (hidden comment: CAP_CERAMIC)
C401  value 100nF 16V  [C0603_N]  (hidden comment: CAP_CERAMIC)
C402  value 100nF 16V  [C0603_N]  (hidden comment: CAP_CERAMIC)
C403  value 100nF 16V  [C0603_N]  (hidden comment: CAP_CERAMIC)
C404  value 100nF 16V  [C0603_N]  (hidden comment: CAP_CERAMIC)
P400  5 Terminal Socket 2,5mm  [WE_691382000005]  (value not drawn)
P401  Header 6  [HDR1X6]  (value not drawn)
U400  value ST3232CDR  [SOIC_N_16]  (hidden comment: RS-232 3V3 Transceiver SOIC)

### Ports
RS232.CTS (out), RS232.RTS (in), RS232.RXD (out), RS232.TXD (in)

### Nets
3V3: C400.1 P401.3 U400.16(VCC)
GND: C400.2 C401.2 C402.2 P400.5 P401.1 U400.15(GND)
RS232.CTS: P401.6 U400.12(R1out) ; port RS232.CTS
RS232.CTS_RS: P400.3 U400.13(R1in)
RS232.RTS: P401.2 U400.11(T1in) ; port RS232.RTS
RS232.RTS_RS: P400.4 U400.14(T1out)
RS232.RXD: P401.4 U400.9(R2out) ; port RS232.RXD
RS232.RXD_RS: P400.2 U400.8(R2in)
RS232.TXD: P401.5 U400.10(T2in) ; port RS232.TXD
RS232.TXD_RS: P400.1 U400.7(T2out)
NetC401_1: C401.1 U400.2(V+)
NetC402_1: C402.1 U400.6(V-)
NetC403_1: C403.1 U400.3(C1-)
NetC403_2: C403.2 U400.1(C1+)
NetC404_1: C404.1 U400.5(C2-)
NetC404_2: C404.2 U400.4(C2+)

### Notes on the sheet
- AREA 3001
- Bernardo
- RS232 Interface
- (near P401) UART4
- Title
- Revision
- Date
- Dranw By
- Size
- A3
- Sheet
- of

### Library data of the parts
C400-C404 = CAP # 100nF 16V 0603: Capacitor Ceramic
P400 = Terminal Block Socket 2,5mm 5way - 691382000005: Value: 691382000005; Supplier 1: Wurth; Supplier Part Number 1: 691382000005
P401 = Pin Header 2.54mm 6way
U400 = ST3232CDR # RS-232 3V3 Transceiver: =Description; Supplier 1: Farnell; Supplier Part Number 1: 2463693

## Sheet CAN.SchDoc: Bernardo
size A3; Date: 14/11/2018; DrawnBy: Wim Van Gool; Revision: 01; SheetNumber: 7; SheetTotal: 7
Used 2 times, as channels CAN1, CAN0. Parts and nets are listed once, with the designators drawn on the sheet.
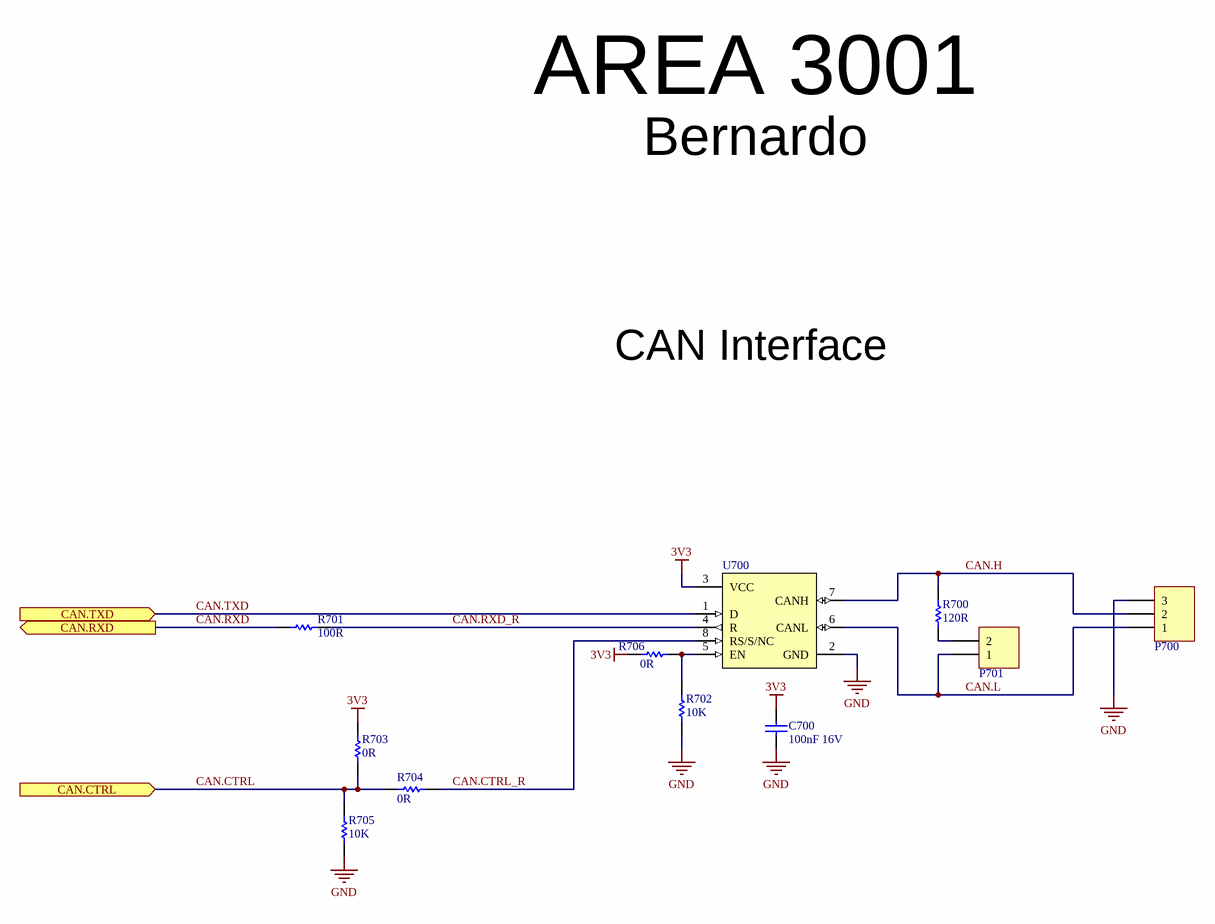
[diagram p6: CAN.SchDoc]

### Parts
C700  value 100nF 16V  [C0603_N]  (hidden comment: CAP_CERAMIC)
P700  3 Terminal Socket 2,5mm  [WE_691382000003]  (value not drawn)
P701  Header 2  [HDR1X2]  (value not drawn)
R700  value 120R  [R1206]  (hidden comment: RESISTOR)
R701  value 100R  [R0603_N]  (hidden comment: RESISTOR)
R702  value 10K  [R0603_N]  (hidden comment: RESISTOR)
R703  value 0R  [R0603_N]  (hidden comment: RESISTOR)
R704  value 0R  [R0603_N]  (hidden comment: RESISTOR)
R705  value 10K  [R0603_N]  (hidden comment: RESISTOR)
R706  value 0R  [R0603_N]  (hidden comment: RESISTOR)
U700  CAN Transceiver 1Mbps 3V3  [SOIC_N_8]  (value not drawn)

### Ports
CAN.CTRL (in), CAN.RXD (out), CAN.TXD (in)

### Nets
3V3: C700.1 R703.1 R706.1 U700.3(VCC)
GND: C700.2 P700.3 R702.2 R705.2 U700.2(GND)
CAN.CTRL: R703.2 R704.1 R705.1 ; port CAN.CTRL
CAN.CTRL_R: R704.2 U700.8(RS/S/NC)
CAN.H: P700.2 R700.1 U700.7(CANH)
CAN.L: P700.1 P701.1 U700.6(CANL)
CAN.RXD: R701.2 ; port CAN.RXD
CAN.RXD_R: R701.1 U700.4(R)
CAN.TXD: U700.1(D) ; port CAN.TXD
NetP701_2: P701.2 R700.2
NetR702_1: R702.1 R706.2 U700.5(EN)

### Channels
CAN1: designators end in _CAN1; ports CAN.CTRL=CAN.CTRL CAN.RXD=CAN.RXD CAN.TXD=CAN.TXD
CAN0: designators end in _CAN0; ports CAN.CTRL=CAN.CTRL CAN.RXD=CAN.RXD CAN.TXD=CAN.TXD

### Notes on the sheet
- AREA 3001
- Bernardo
- CAN Interface
- Title
- Revision
- Date
- Dranw By
- Size
- A3
- Sheet
- of

### Library data of the parts
C700 = CAP # 100nF 16V 0603: Capacitor Ceramic
P700 = Terminal Block Socket 2,5mm 3way - 691382000003: Value: 691382000003; Supplier 1: Wurth; Supplier Part Number 1: 691382000003
P701 = Pin Header 2.54mm 2way
R700 = RES # 120R 1206
R701 = RES # 100R 0603
R702 R705 = RES # 10K 0603: Supplier 1: Farnell; Supplier Part Number 1: 2502397
R703 R704 R706 = RES # 0R 0603: Supplier 1: Farnell; Supplier Part Number 1: 2447743
U700 = SN65HVD232DR CAN Transceiver 1Mbps: =Description; Value: SN65HVD232DR; Supplier 1: Farnell; Supplier Part Number 1: 1103107; Supplier 2: Digi-key; Supplier Part Number 2: 296-26344-1-ND

## Nets that join several sheets
3V3: Misc (16 pins), RS485 (C600.1 P602.3 R601.1 U600.8), BBB_Headers (5 pins), Logic_buffer (9 pins), RS232 (C400.1 P401.3 U400.16), CAN1 (C700_CAN1.1 R703_CAN1.1 R706_CAN1.1 U700_CAN1.3), CAN0 (C700_CAN0.1 R703_CAN0.1 R706_CAN0.1 U700_CAN0.3)
5V: Misc (P503.4 R501.1 R503.1), BBB_Headers (P201.5 P201.6)
GND: Misc (12 pins), RS485 (C600.2 P600.3 P602.1 U600.5), BBB_Headers (11 pins), Logic_buffer (29 pins), RS232 (6 pins), CAN1 (5 pins), CAN0 (5 pins)
VADC: BBB_Headers (P201.31), Logic_buffer (SW1.6)
CAN.CTRL: BBB_Headers (P201.16), CAN0 (R703_CAN0.2 R704_CAN0.1 R705_CAN0.1)
CAN.CTRL: BBB_Headers (P201.26), CAN1 (R703_CAN1.2 R704_CAN1.1 R705_CAN1.1)
CAN.RXD: BBB_Headers (P201.20), CAN0 (R701_CAN0.2)
CAN.RXD: BBB_Headers (P201.23), CAN1 (R701_CAN1.2)
CAN.TXD: BBB_Headers (P201.19), CAN0 (U700_CAN0.1)
CAN.TXD: BBB_Headers (P201.25), CAN1 (U700_CAN1.1)
EEPROM.SCL: Misc (P502.2 T502.2 U500.6 U502.6), BBB_Headers (P201.18 R201.1)
EEPROM.SDA: Misc (P502.3 T501.2 U500.5 U502.5), BBB_Headers (P201.17 R200.2)
GPIO1_12: Misc (T500.1), BBB_Headers (P200.11)
GPIO1_13: Misc (C502.1 R507.2), BBB_Headers (P200.12)
GPIO1_17: Misc (P500.2 R504.1), BBB_Headers (P201.24)
GPIO1_28: Misc (R502.2 U500.7), BBB_Headers (P201.11)
GPIO2_6: BBB_Headers (P200.46), Logic_buffer (U301.2)
GPIO2_7: BBB_Headers (P200.45), Logic_buffer (U301.3)
GPIO2_8: BBB_Headers (P200.44 P204.2), Logic_buffer (U301.5)
GPIO2_9: BBB_Headers (P200.43), Logic_buffer (U301.6)
GPIO2_10: BBB_Headers (P200.42), Logic_buffer (U301.8)
GPIO2_11: BBB_Headers (P200.41), Logic_buffer (U301.9)
GPIO2_12: BBB_Headers (P200.40), Logic_buffer (U301.11)
GPIO2_13: BBB_Headers (P200.39), Logic_buffer (U301.12)
GPIO2_22: BBB_Headers (P200.28), Logic_buffer (U301.16)
GPIO2_23: BBB_Headers (P200.30), Logic_buffer (U301.13)
GPIO2_24: BBB_Headers (P200.27), Logic_buffer (U301.14)
GPIO2_25: BBB_Headers (P200.29), Logic_buffer (U301.17)
L.CH13: BBB_Headers (R204.1), Logic_buffer (U301.19)
L.CH14: BBB_Headers (R205.1), Logic_buffer (U301.20)
L.DIR1: BBB_Headers (P200.35), Logic_buffer (R305.1 U301.1)
L.DIR2: BBB_Headers (P200.33), Logic_buffer (R306.1 U301.24)
RS232.CTS: BBB_Headers (P200.36), RS232 (P401.6 U400.12)
RS232.RTS: BBB_Headers (P200.34), RS232 (P401.2 U400.11)
RS232.RXD: BBB_Headers (P201.12), RS232 (P401.4 U400.9)
RS232.TXD: BBB_Headers (P201.14), RS232 (P401.5 U400.10)
RS485.DIR: RS485 (R605.2), BBB_Headers (P200.31)
RS485.RXD: RS485 (P602.4 R600.2), BBB_Headers (P200.37)
RS485.TXD: RS485 (P602.5 U600.4), BBB_Headers (P200.38)
SPI1.CS0: Misc (P504.1), BBB_Headers (P201.27)
SPI1.D0: Misc (P504.3), BBB_Headers (P201.30)
SPI1.D1: Misc (P504.4), BBB_Headers (P201.29)
SPI1.SCLK: Misc (P504.5), BBB_Headers (P201.32)
SYS_RESETn: BBB_Headers (P201.9), Logic_buffer (R302.2)

## Assembly variants
DEFAULT: not fitted C604 D600 P203 P401 P602 R204 R205 R304 R603 R604 R703 R703_CAN0 R706 R706_CAN0 U603
DEFAULT_BASIC: not fitted BAT500 C400 C401 C402 C403 C404 C500 C501 C503 C600 C601 C604 C700 C700_CAN0 D600 P400 P400 P401 P500 P501 P600 P600 P601 P602 P700 P700_CAN0 P701 P701_CAN0 R204 R205 R304 R500 R502 R505 R508 R509 R510 R511 R512 R600 R601 R602 R603 R604 R605 R700 R700_CAN0 R701 R701_CAN0 R702 R702_CAN0 R703 R703_CAN0 R704 R704_CAN0 R705 R705_CAN0 R706 R706_CAN0 U400 U500 U501 U502 U600 U603 U700 U700_CAN0 Y500